# EasyEDA schematic senseStack_MainModule_schematic.json
TITLE: SenseStack - Main Module; REV: 1.0; Date: 2020-01-27; Sheet: 1/1; Drawn By: Sitinut W.; Company: SW Project 3
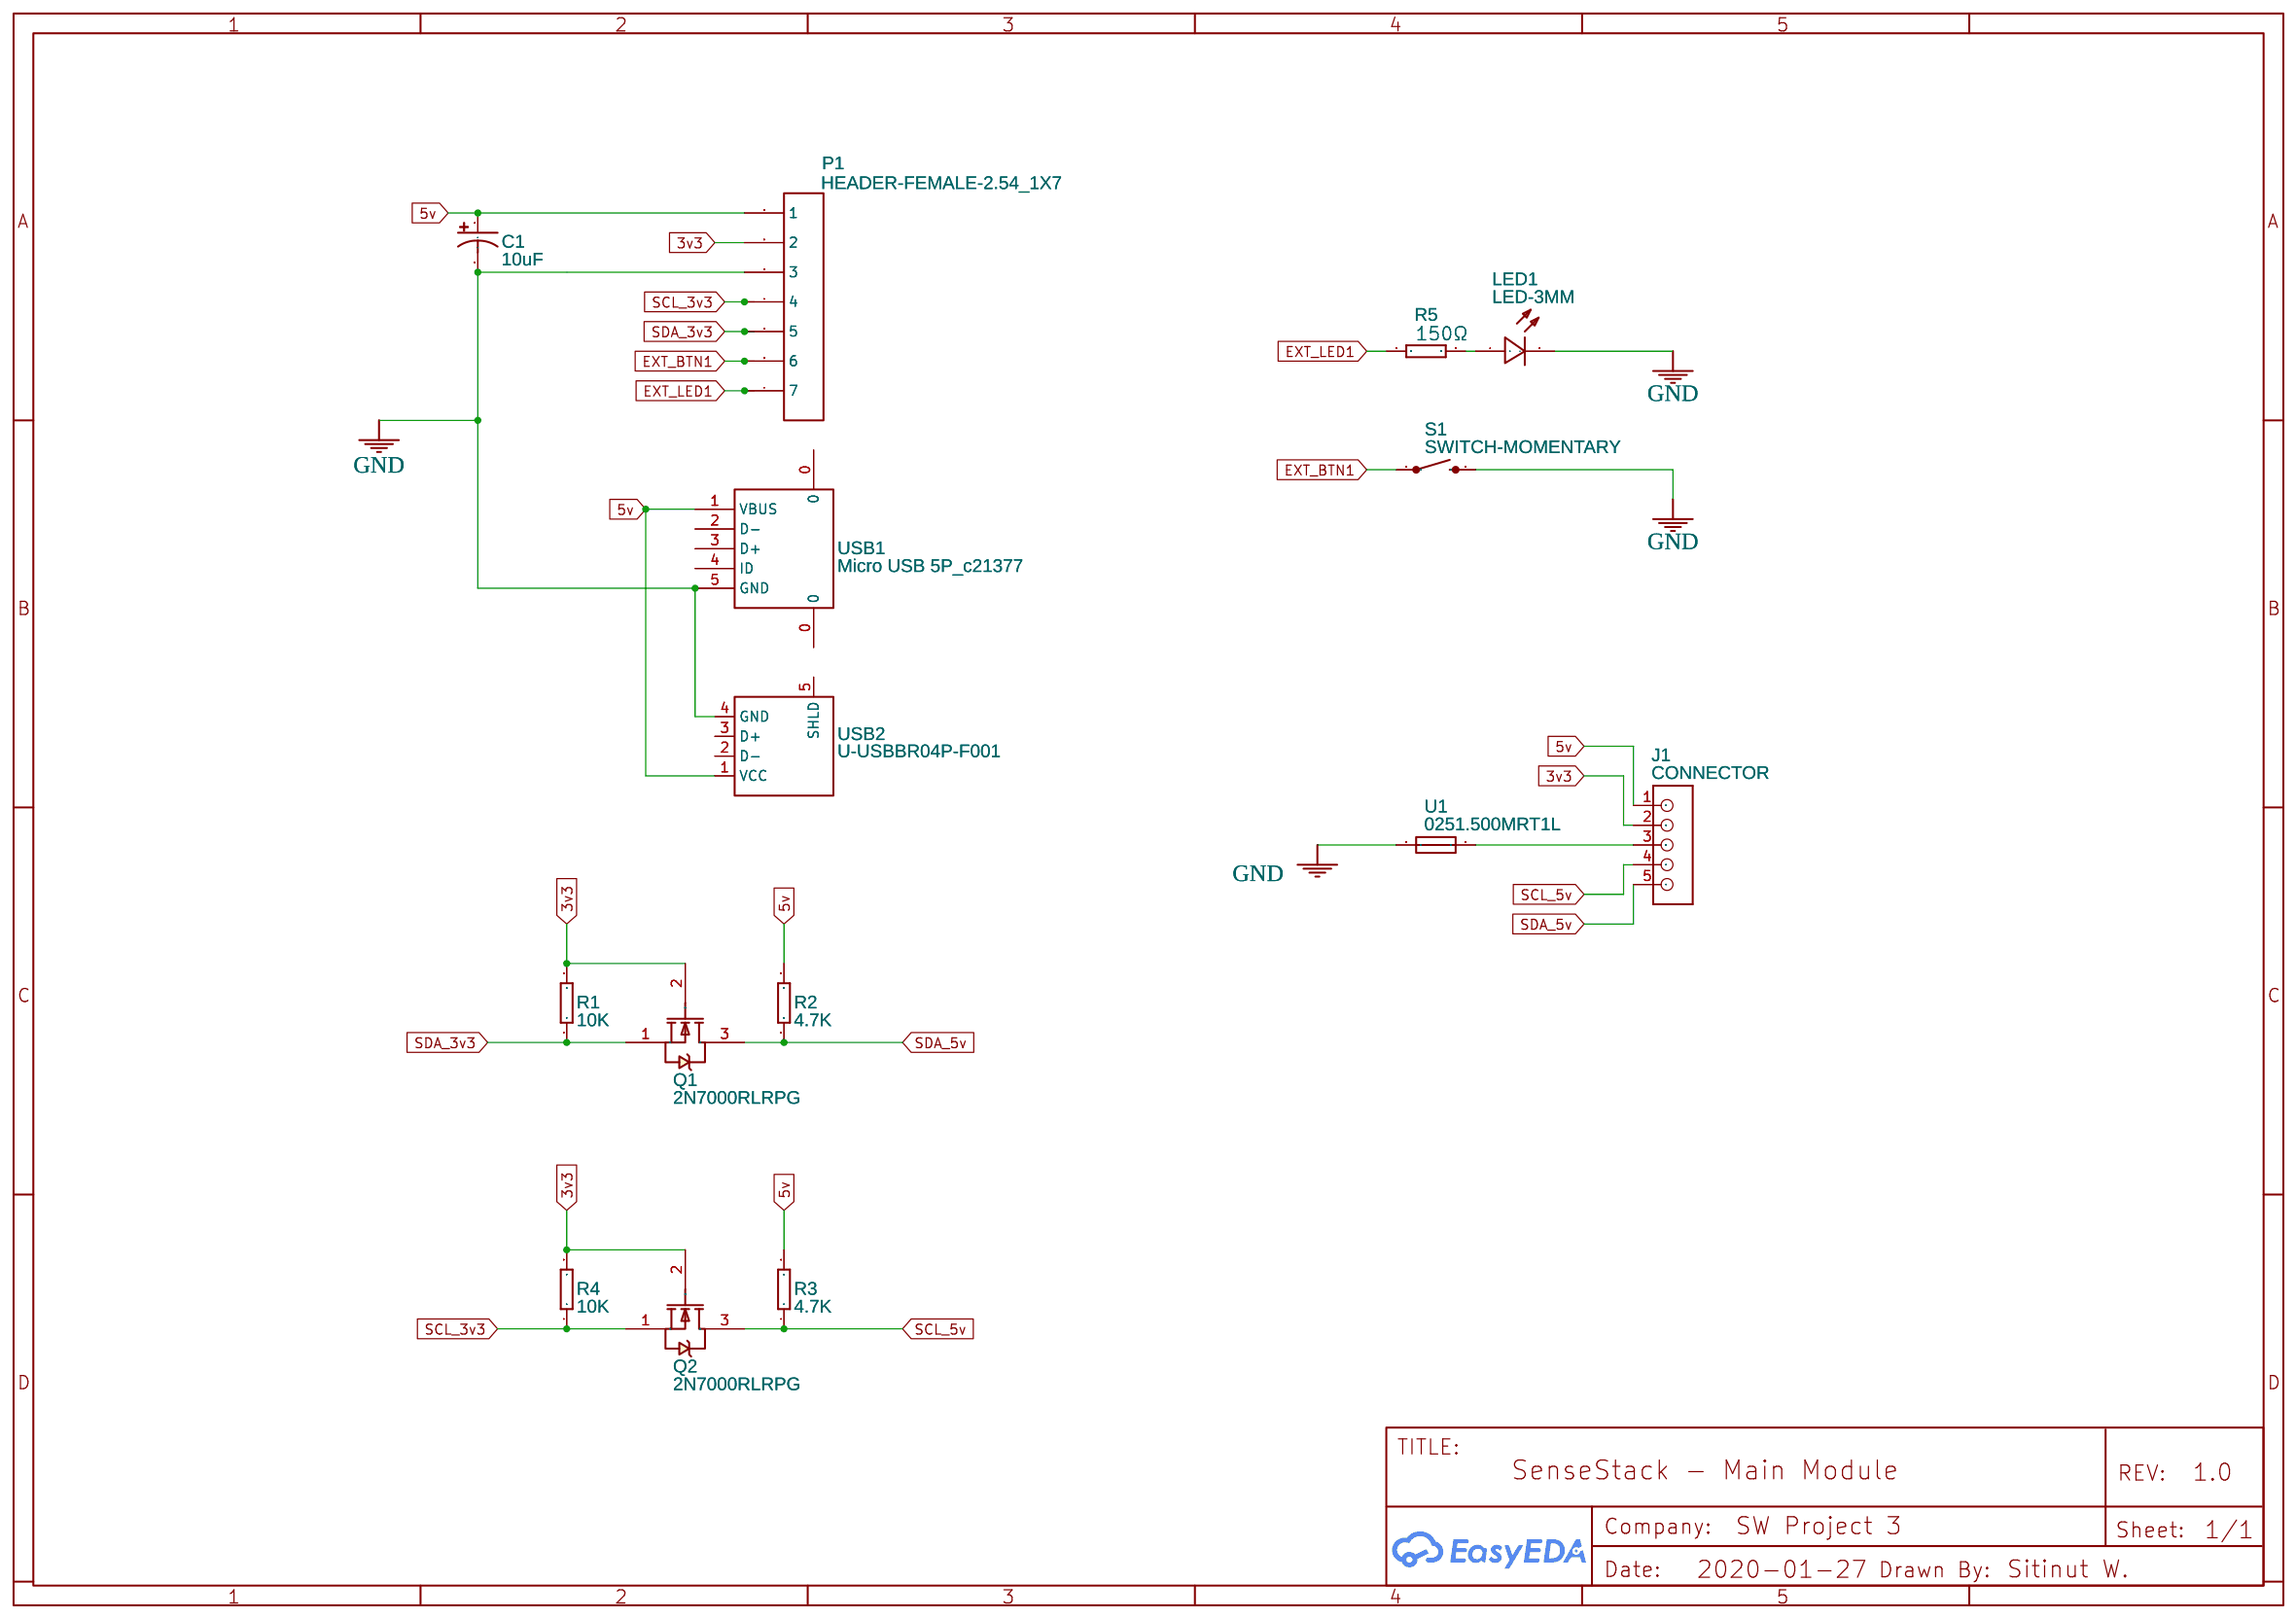
[diagram p0: schematic sheet]

## Parts
C1  10uF  [CPOL-RADIAL-10UF-25V-KIT]
J1  CONNECTOR  [HDR1X5]
LED1  LED-3MM  [LED-3MM/2.54]
P1  HEADER-FEMALE-2.54_1X7  [HDR-7X1/2.54]
Q1  2N7000RLRPG  [ONSC-TO-92-3-29-11_AM_BL]
Q2  2N7000RLRPG  [ONSC-TO-92-3-29-11_AM_BL]
R1  10K  [RTH025W]
R2  4.7K  [RTH025W]
R3  4.7K  [RTH025W]
R4  10K  [RTH025W]
R5  150Ω  [RTH025W]
S1  SWITCH-MOMENTARY  [TACTILE-PTH-SIDEEZ]
U1  0251.500MRT1L  [FUSE-TH_BD2.8-L7.1-P11.10-D0.9]
USB1  Micro USB 5P_c21377  [MICRO-USB-SMD_5P-P0.65-H-M_MICRO-USB-5P]
USB2  U-USBBR04P-F001  [USB-B-TH_U241-041N-1BR85-1]

## Library data of the parts
C1 = 10UF-25V-20%(PTH)KIT: CAP-08440; Contributor: SparkFun
J1 = CONNECTOR_HEADER-6P_CONNECTOR_6P-2.54-8040MIL
LED1 = LED-3MM: Supplier: LCSC; Manufacturer: EVERLIGHT; Manufacturer Part: 204-10SURD/S530-A3; Supplier Part: C99772
P1 = HEADER-FEMALE-2.54_1X7: Supplier Part: undefined; Supplier: LCSC; Manufacturer: LCSC; Manufacturer Part: Header-Female-2.54_1x10
Q1 Q2 = 2N7000RLRPG: Small Signal MOSFET, 200 mA, 60 V, N-Channel, 3-Pin TO-92, Pb-Free, Fan-Fold
R1-R5 = RESISTOR: Contributor: DangerousPrototype
S1 = SWITCH-MOMENTARY-2SIDE_EZ: Various NO switches- pushbuttons, reed, etc; Contributor: SparkFun
U1 = 0251.500MRT1L: Supplier: LCSC; Supplier Part: C142873; Manufacturer: Littelfuse; Contributor: LCSC
USB1 = Micro USB 5P_c21377: Supplier: LCSC; Supplier Part: C21377; Manufacturer: Boom Precision Elec; Contributor: 立创EDA官方封装库
USB2 = U-USBBR04P-F001: Supplier: LCSC; Supplier Part: C386743; Manufacturer: Shenzhen Cankemeng; Contributor: LCSC

## Nets
3v3: J1.2 P1.2 Q1.2(G) Q2.2(G) R1.2 R4.2
5v: C1.1(+) J1.1 P1.1 R2.2 R3.2 USB1.1(VBUS) USB2.1(VCC)
GND: C1.2(-) LED1.2(-) P1.3 S1.2 U1.1 USB1.5(GND) USB2.4(GND)
EXT_BTN1: P1.6 S1.1
EXT_LED1: P1.7 R5.1
SCL_3v3: P1.4 Q2.1(S) R4.1
SCL_5v: J1.4 Q2.3(D) R3.1
SDA_3v3: P1.5 Q1.1(S) R1.1
SDA_5v: J1.5(4) Q1.3(D) R2.1
Net-(J1-3): J1.3 U1.2
Net-(LED1-1): LED1.1(+) R5.2

Not connected (* = marked no-connect by the designer): USB1 0 2(D-) 3(D+) 4(ID); USB2 2(D-) 3(D+) 5(SHLD)
